# EAGLE design HeatBed (EAGLE 7.2.0)
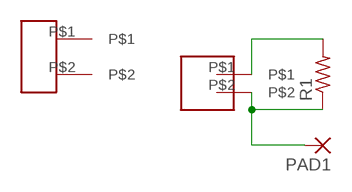
[diagram p0: schematic, sheet 1]

## Parts
PAD1  3,81/1,4  [3,81/1,4]
R1  R-US_M0805  [M0805]
U$2  SMD_WAFER_2  [SMD_WAFER_02]
U$3  SMD_TERMINAL_2  [SMD_5MM_2]

## Nets
N$20: R1.2
N$21: PAD1.1(P) R1.1
Unconnected: U$2.P$1 U$2.P$2 U$3.P$1 U$3.P$2

## Library data of the parts
PAD1 = wirepad:3,81/1,4: THROUGH-HOLE PAD
R1 = rcl:R-US_: RESISTOR, American symbol
U$2 = Ateam_Eagle:SMD_WAFER_2
U$3 = Ateam_Eagle:SMD_TERMINAL_2

## Net classes
0 default: clearance 0.205 mm

## Board
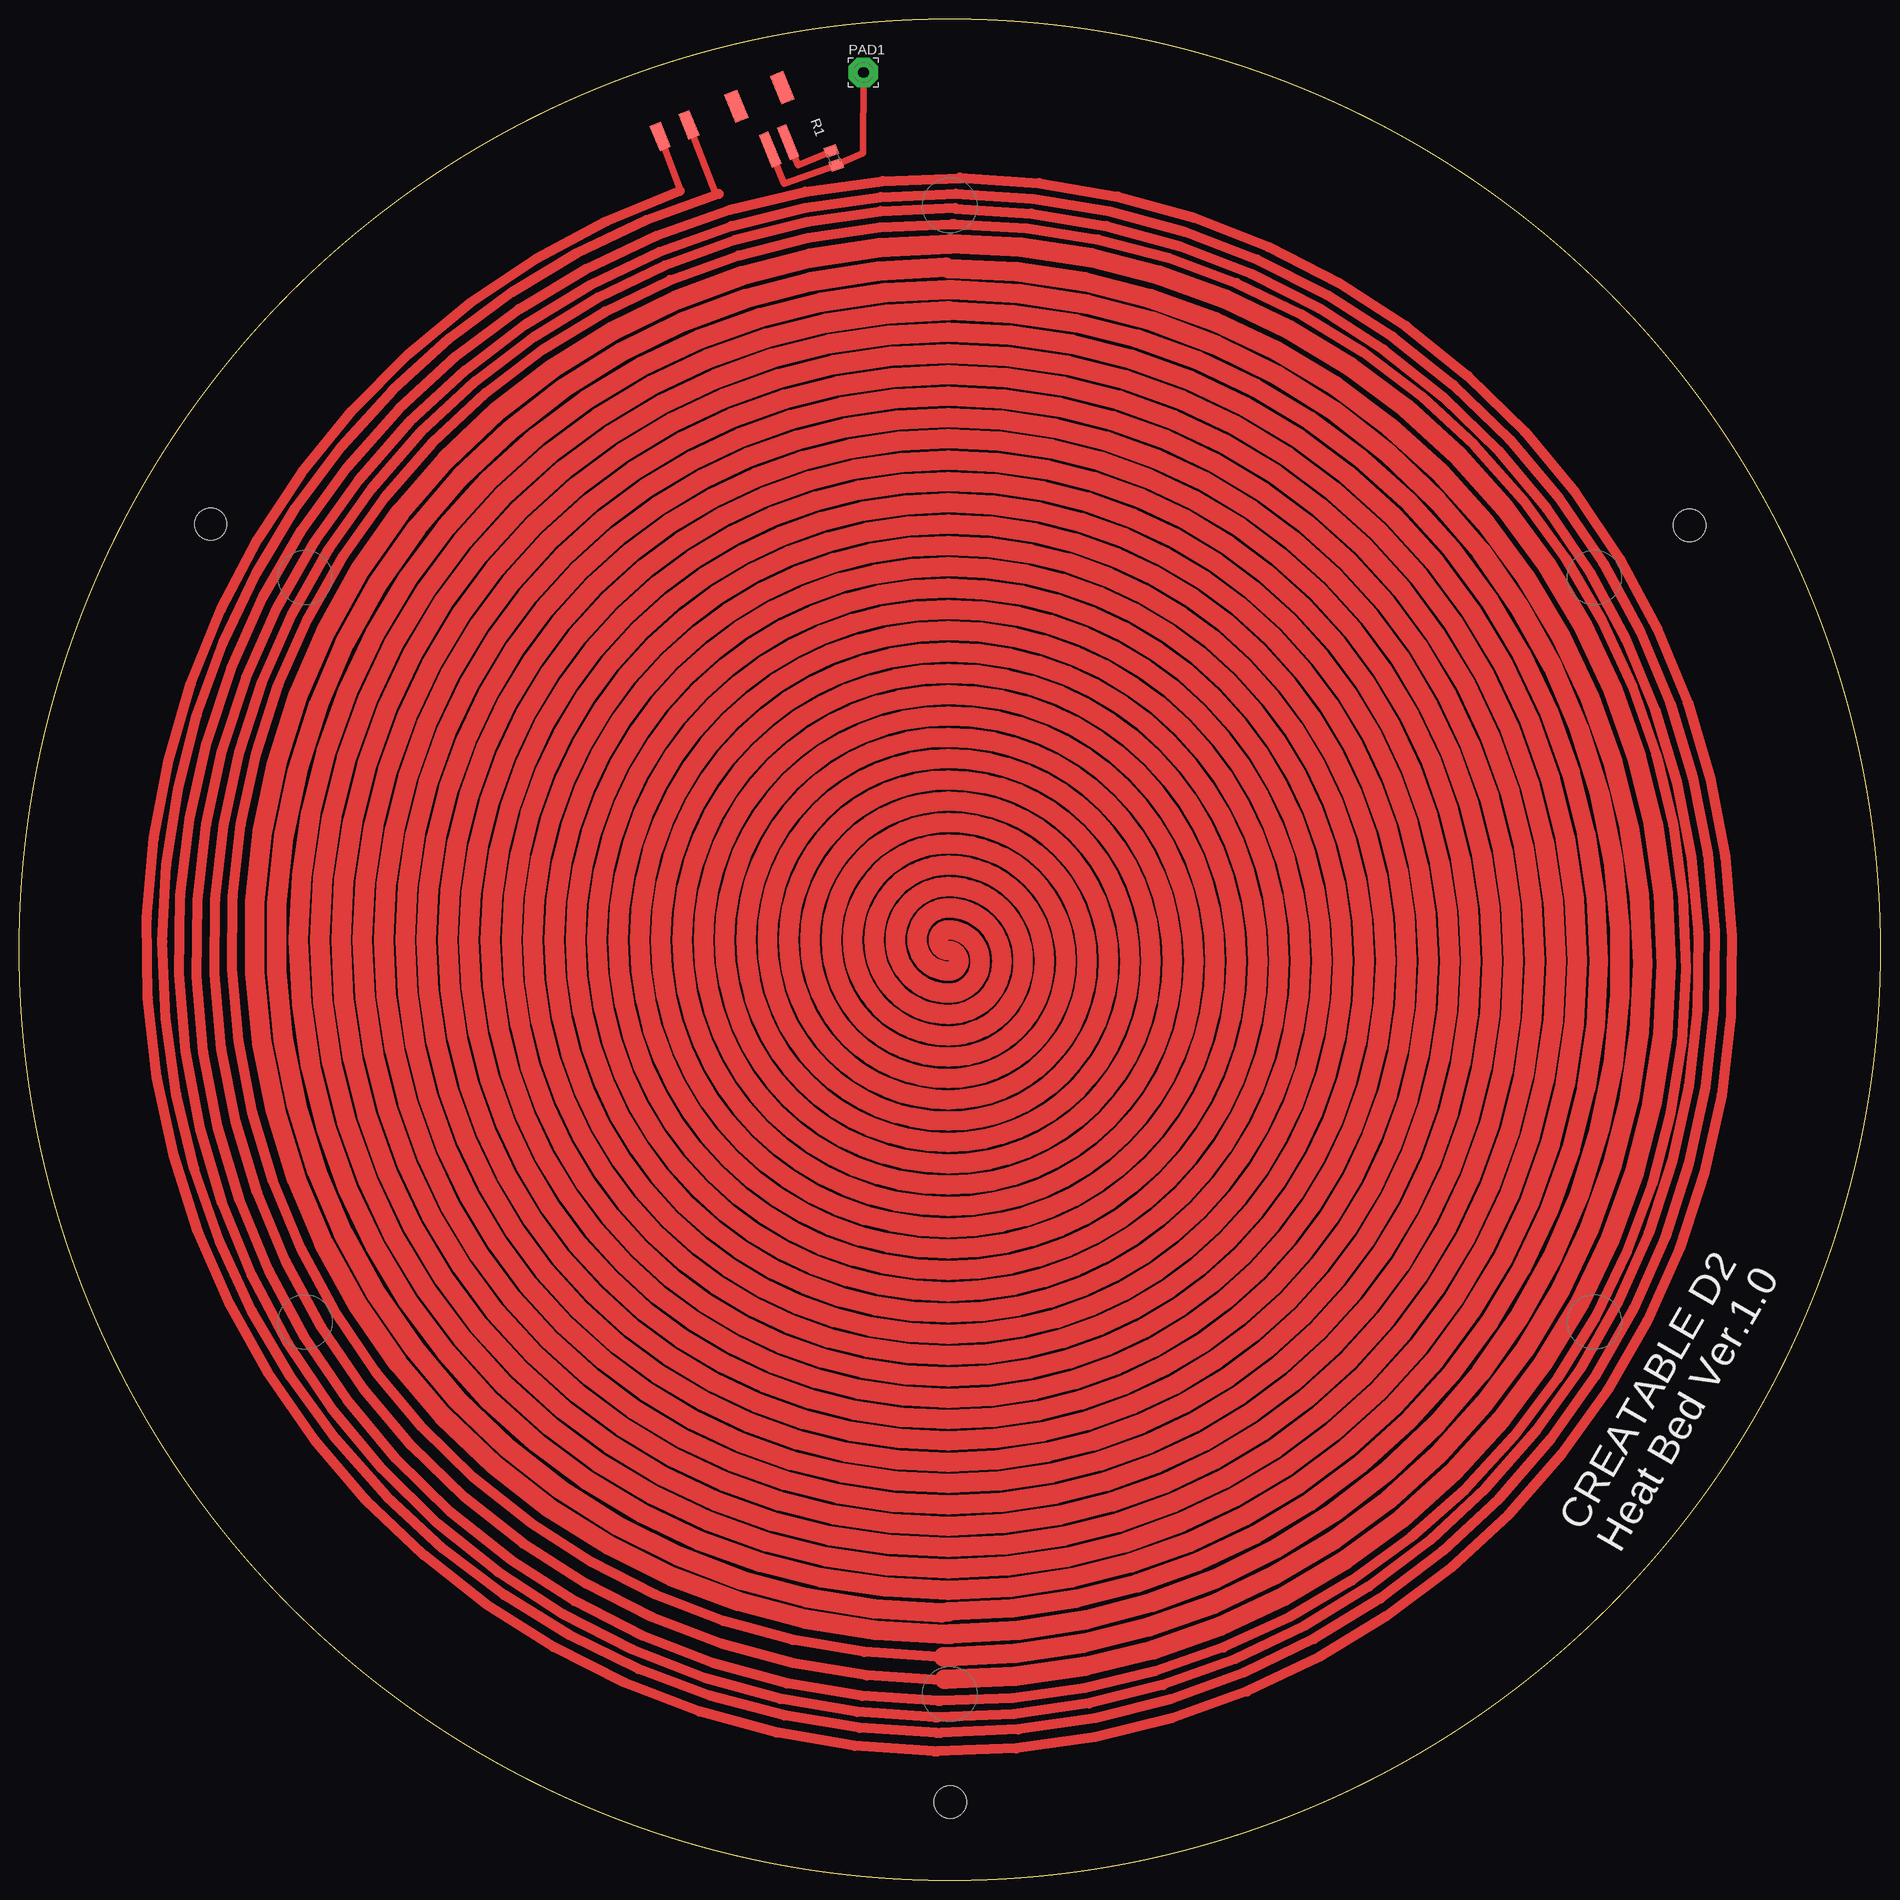
[diagram p1: board, top side]

Size 240 x 240 mm. Coordinates in mm from the lower left corner, seen from the top.
Outline: circle at 120,120 radius 120
Copper layers (1*16): Top 0.035mm / dielectric 1.5mm / Bottom 0.035mm
Design rules "default": minimum track width 10mil, minimum drill 24mil, track to track 8mil, track to pad 8mil, pad to pad 8mil, via to via 8mil, smd to smd 8mil, copper to edge 40mil, drill to drill 8mil, minimum pad ring 10mil, minimum via ring 8mil, stop-mask expansion 4mil, vias tented up to drill 0mil, thermal gap 10mil
Holes 4.2 mm at 24.67,174.9 120.08,10.05 215.4,174.75

### Footprints (pad centres in the part's own frame; a part is rotated, then mirrored left to right if it is on the bottom)
3,81/1,4 = drill 1.397 pad 3.81 octagon: 1 0,0
M0805 = smd 1.3 x 1.6: 1 -0.95,0; 2 0.95,0
SMD_WAFER_02 = smd 1.8 x 3.9: P$1 -3.2,1.95; P$4 3.2,1.95 | smd 1.3 x 4.5: P$2 1.25,8.75; P$3 -1.25,8.75
SMD_5MM_2 = smd 1.5 x 3.5: P$1 -2,0; P$2 2,0

### Placement (x,y rotation side)
PAD1  108.86,233.15 0 top
R1  105.04,222.13 110 top
U$2  94.71,231.81 202 top
U$3  84.51,225.65 22 top

### Tracks (layer width: path | path; a pad name or v marks a point on that pad's centre or on a via)
CCW
  Top 0.254: 120.22,205.15 119.85,206.26 119.85,205.15
  Top 0.406: 85.3,217.9 85.2,217.9 | 89.8,217.4 90.2,217.4 90.2,217.5
  Top 0.813: 118.3,19 118.8,19 | 118.3,16.6 118,16.6
  Top 1.27: 118.8,19 arc180 120.7,217.5 120.9,217.5 arc180 118.5,23.1 118.8,23.1 arc180 120.6,213.6 120.3,213.6 arc179 118.3,28.8 119,28.8 119,28.83 119.17,28.83 | 118.4,16.6 118.3,16.6 arc180 121.3,219.6 121.3,219.5 121.4,219.5 arc180 118.1,21 118.4,21 arc180 120.7,215.6 120.7,215.7 arc180 118.9,25.8 118.9,25.88 119.35,25.88 | 118,16.6 arc-159 85.2,217.9 | 118.3,19 arc-162 90.2,217.5
  Top 2.184: 118.95,34.47 119.85,34.47 119.85,34.65 | 120.28,205.12 120.22,205.12 120.22,205.15 | 119.5,208.03 119.92,208.03 119.92,207.88 | 120.12,211.1 120,211.1 120,210.97
  Top 2.4: 119.85,202.4 arc-180 119.85,34.65
  Top 2.5: 119.85,205.15 arc180 119.85,37.4 arc180 119.85,199.65 arc180 119.85,42.9 arc180 119.85,194.15 arc180 119.85,48.4 arc180 119.85,188.65 arc180 119.85,53.9 arc180 119.85,183.15 arc180 119.85,59.4 arc180 119.85,177.65 arc180 119.85,64.9 arc180 119.85,172.15 arc180 119.85,70.4 arc180 119.85,166.65 arc180 119.85,75.9 arc180 119.85,161.15 arc180 119.85,81.4 arc180 119.85,155.65 arc180 119.85,86.9 arc180 119.85,150.15 arc180 119.85,92.4 arc180 119.85,144.65 arc180 119.85,97.9 arc180 119.85,139.15 arc180 119.85,103.4 arc180 119.85,133.65 arc180 119.85,108.9 arc180 119.85,128.15 arc180 119.85,114.4 arc180 119.85,122.55 arc180 119.85,119.9 arc-180 119.85,117.25 arc-180 119.85,125.4 arc-180 119.85,111.65 arc-180 119.85,130.9 arc-180 119.85,106.15 arc-180 119.85,136.4 arc-180 119.85,100.65 arc-180 119.85,141.9 arc-180 119.85,95.15 arc-180 119.85,147.4 arc-180 119.85,89.65 arc-180 119.85,152.9 arc-180 119.85,84.15 arc-180 119.85,158.4 arc-180 119.85,78.65 arc-180 119.85,163.9 arc-180 119.85,73.15 arc-180 119.85,169.4 arc-180 119.85,67.65 arc-180 119.85,174.9 arc-180 119.85,62.15 arc-180 119.85,180.4 arc-180 119.85,56.65 arc-180 119.85,185.9 arc-180 119.85,51.15 arc-180 119.85,191.4 arc-180 119.85,45.65 arc-180 119.85,196.9 arc-180 119.85,40.15 arc-180 119.85,202.4 | 120,210.97 arc180 119.47,31.72 120.1,31.72 120.1,31.78 120.2,31.78 arc180 120.28,205.12 | 119.92,207.88 arc-180 119.72,28.83 119.17,28.83 | 120.12,211.1 arc-180 119.35,25.88 119.5,25.88 | 118.95,34.47 arc-179 119.5,208.03
  pour Top: 129.03,35.25 122.99,35.28 arc90 122.85,34.92
N$4
  Top 0.813: 85.25,217.89 82.58,225.15
N$7
  Top 0.813: 89.72,217.72 86.24,226.66
N$21
  Top 0.813: R1.1 108.84,222.74 PAD1.1
N$22
  Top 0.813: 104.79,222.99 100.4,221.19 98.68,225.36
N$23
  Top 0.813: 105.38,221.22 98.65,218.78 96.4,224.32

### Text on the board
tNames: CREATABLE D2 / Heat Bed Ver.1.0
Document: Up